# Altium schematic sheet InterfaceBoard.SchDoc: Interfaceboard interface
size A4; Organization: Institut d'Automatisation Industrielle; SheetNumber: 1; SheetTotal: 3; SVN: OUI; CurrentTime: 6; CurrentDate: 5; DocumentFullPathAndName: 8; DocumentName: 9; ModifiedDate: 13; ProjectName: <projet>
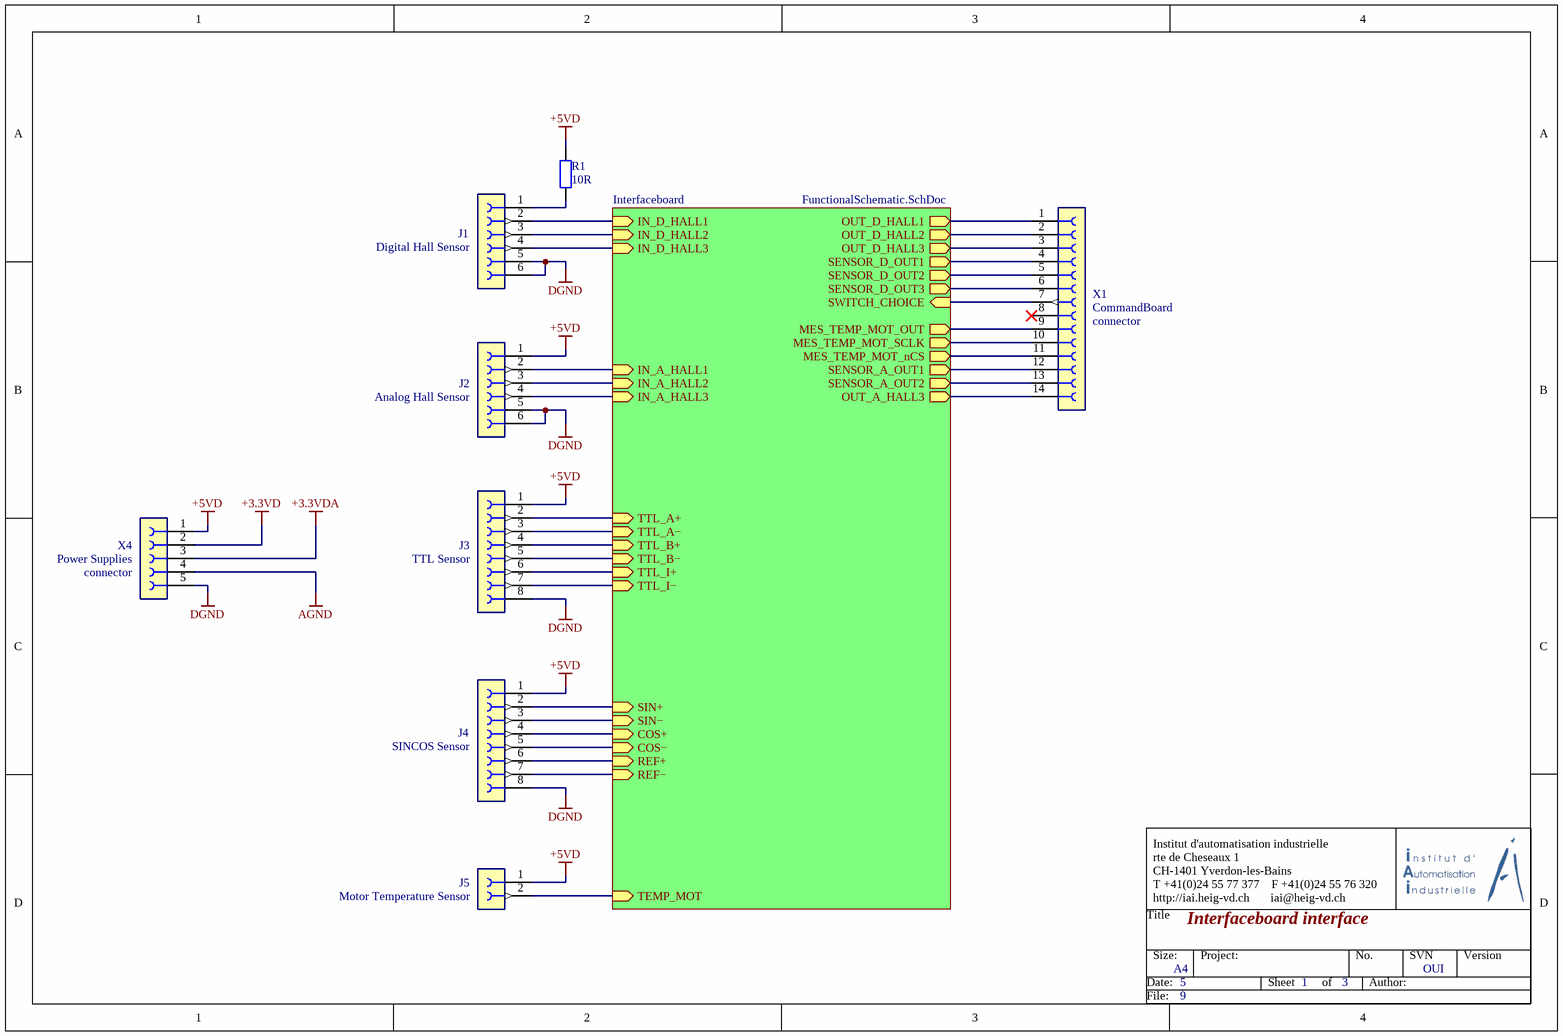
[diagram p0: InterfaceBoard.SchDoc]

## Parts
J1  Use: Digital Hall Sensor  [TE_7-215079-6]  (hidden comment: CONNECT SMD 6pos 180°)
J2  Use: Analog Hall Sensor  [TE_7-215079-6]  (hidden comment: CONNECT SMD 6pos 180°)
J3  Use: TTL Sensor  [TE_7-215079-8]  (hidden comment: CONNECT SMD 8pos 180°)
J4  Use: SINCOS Sensor  [TE_7-215079-8]  (hidden comment: CONNECT SMD 8pos 180°)
J5  Use: Motor Temperature Sensor  [62000611821 - 2pin]  (hidden comment: CONNECT 2pos 90°)
R1  value 10R  [RESC1508X04N]  (hidden comment: RES SMD 10R 0603)
X1  Use: CommandBoard  system: connector  [62301421021]  (hidden comment: CONNECT SMD 16pos 180°)
X4  Use: Power Supplies  system: connector  [62000611821 - 5pin]  (hidden comment: CONNECT HEADER 5pos 180°)

## Sub-sheets
Interfaceboard = FunctionalSchematic.SchDoc: IN_D_HALL1 (in), TTL_A+ (in), REF+ (in), OUT_D_HALL3 (out), SENSOR_D_OUT3 (out), SIN− (in), SENSOR_D_OUT2 (out), TTL_B− (in), OUT_D_HALL1 (out), COS+ (in), OUT_D_HALL2 (out), COS− (in), IN_D_HALL3 (in), SIN+ (in), TTL_A− (in), IN_D_HALL2 (in), TTL_B+ (in), TTL_I− (in), REF− (in), SENSOR_D_OUT1 (out), TTL_I+ (in), IN_A_HALL3 (in), OUT_A_HALL3 (out), IN_A_HALL1 (in), IN_A_HALL2 (in), TEMP_MOT (in), MES_TEMP_MOT_SCLK (out), SENSOR_A_OUT2 (out), MES_TEMP_MOT_nCS (out), MES_TEMP_MOT_OUT (out), SENSOR_A_OUT1 (out), SWITCH_CHOICE (in)

## Nets
+3.3VD: X4.2
+3.3VDA: X4.3
+5VD: J2.1 J3.1 J4.1 J5.1 R1.2 X4.1
AGND: X4.4
DGND: J1.5 J1.6 J2.5 J2.6 J3.8 J4.8 X4.5
NetJ1_1: J1.1 R1.1
NetJ1_2: J1.2 ; sheet Interfaceboard/IN_D_HALL1
NetJ1_3: J1.3 ; sheet Interfaceboard/IN_D_HALL2
NetJ1_4: J1.4 ; sheet Interfaceboard/IN_D_HALL3
NetJ2_2: J2.2 ; sheet Interfaceboard/IN_A_HALL1
NetJ2_3: J2.3 ; sheet Interfaceboard/IN_A_HALL2
NetJ2_4: J2.4 ; sheet Interfaceboard/IN_A_HALL3
NetJ3_2: J3.2 ; sheet Interfaceboard/TTL_A+
NetJ3_3: J3.3 ; sheet Interfaceboard/TTL_A−
NetJ3_4: J3.4 ; sheet Interfaceboard/TTL_B+
NetJ3_5: J3.5 ; sheet Interfaceboard/TTL_B−
NetJ3_6: J3.6 ; sheet Interfaceboard/TTL_I+
NetJ3_7: J3.7 ; sheet Interfaceboard/TTL_I−
NetJ4_2: J4.2 ; sheet Interfaceboard/SIN+
NetJ4_3: J4.3 ; sheet Interfaceboard/SIN−
NetJ4_4: J4.4 ; sheet Interfaceboard/COS+
NetJ4_5: J4.5 ; sheet Interfaceboard/COS−
NetJ4_6: J4.6 ; sheet Interfaceboard/REF+
NetJ4_7: J4.7 ; sheet Interfaceboard/REF−
NetJ5_2: J5.2 ; sheet Interfaceboard/TEMP_MOT
NetX1_1: X1.1 ; sheet Interfaceboard/OUT_D_HALL1
NetX1_2: X1.2 ; sheet Interfaceboard/OUT_D_HALL2
NetX1_3: X1.3 ; sheet Interfaceboard/OUT_D_HALL3
NetX1_4: X1.4 ; sheet Interfaceboard/SENSOR_D_OUT1
NetX1_5: X1.5 ; sheet Interfaceboard/SENSOR_D_OUT2
NetX1_6: X1.6 ; sheet Interfaceboard/SENSOR_D_OUT3
NetX1_7: X1.7 ; sheet Interfaceboard/SWITCH_CHOICE
NetX1_9: X1.9 ; sheet Interfaceboard/MES_TEMP_MOT_OUT
NetX1_10: X1.10 ; sheet Interfaceboard/MES_TEMP_MOT_SCLK
NetX1_11: X1.11 ; sheet Interfaceboard/MES_TEMP_MOT_nCS
NetX1_12: X1.12 ; sheet Interfaceboard/SENSOR_A_OUT1
NetX1_13: X1.13 ; sheet Interfaceboard/SENSOR_A_OUT2
NetX1_14: X1.14 ; sheet Interfaceboard/OUT_A_HALL3

Not connected (* = marked no-connect by the designer): X1 8*

## Notes on the sheet
- Title
- Institut d'automatisation industrielle
  rte de Cheseaux 1
  CH-1401 Yverdon-les-Bains
  T +41(0)24 55 77 377    F +41(0)24 55 76 320
  http://iai.heig-vd.ch       iai@heig-vd.ch
- Date:
- Size:
- A4
- Project:
- Sheet
- of
- No.
- Author:
- SVN
- Version
- File:

## Library data of the parts
J1 J2 = CONNECT SMD 6pos 180° 2.54mm: Value: *
J3 J4 = CONNECT SMD 8pos 180° 2.54mm: Value: *
J5 = CONNECT 2pos 90° 3.81mm: 2 Positions, bloc de jonction Embase, broche mâle, gainée (4 côtés) 0,150 po (3,81mm) 90°, engle droit Trou traversant; Value: WR-TBL322; Supplier 1: Digi-Key; Supplier Part Number 1: 732-2088-ND
R1 = RES SMD 10 OHM 1% 1/10W 0603: 10 Ohms ±1% 0,1W, 1/10W Pavé résistif 0603 (1608 métrique) AutomobileAEC-Q200 Couche épaisse; Supplier 1: Digi-Key; Supplier Part Number 1: RMCF0603FT10R0CT-ND
X1 = CONNECT SMD 16pos 180° 2.54mm: Value: *
X4 = CONNECT HEADER 5pos 180° 2mm: Value: *